# Altium schematic sheet MCU.SchDoc
size A3
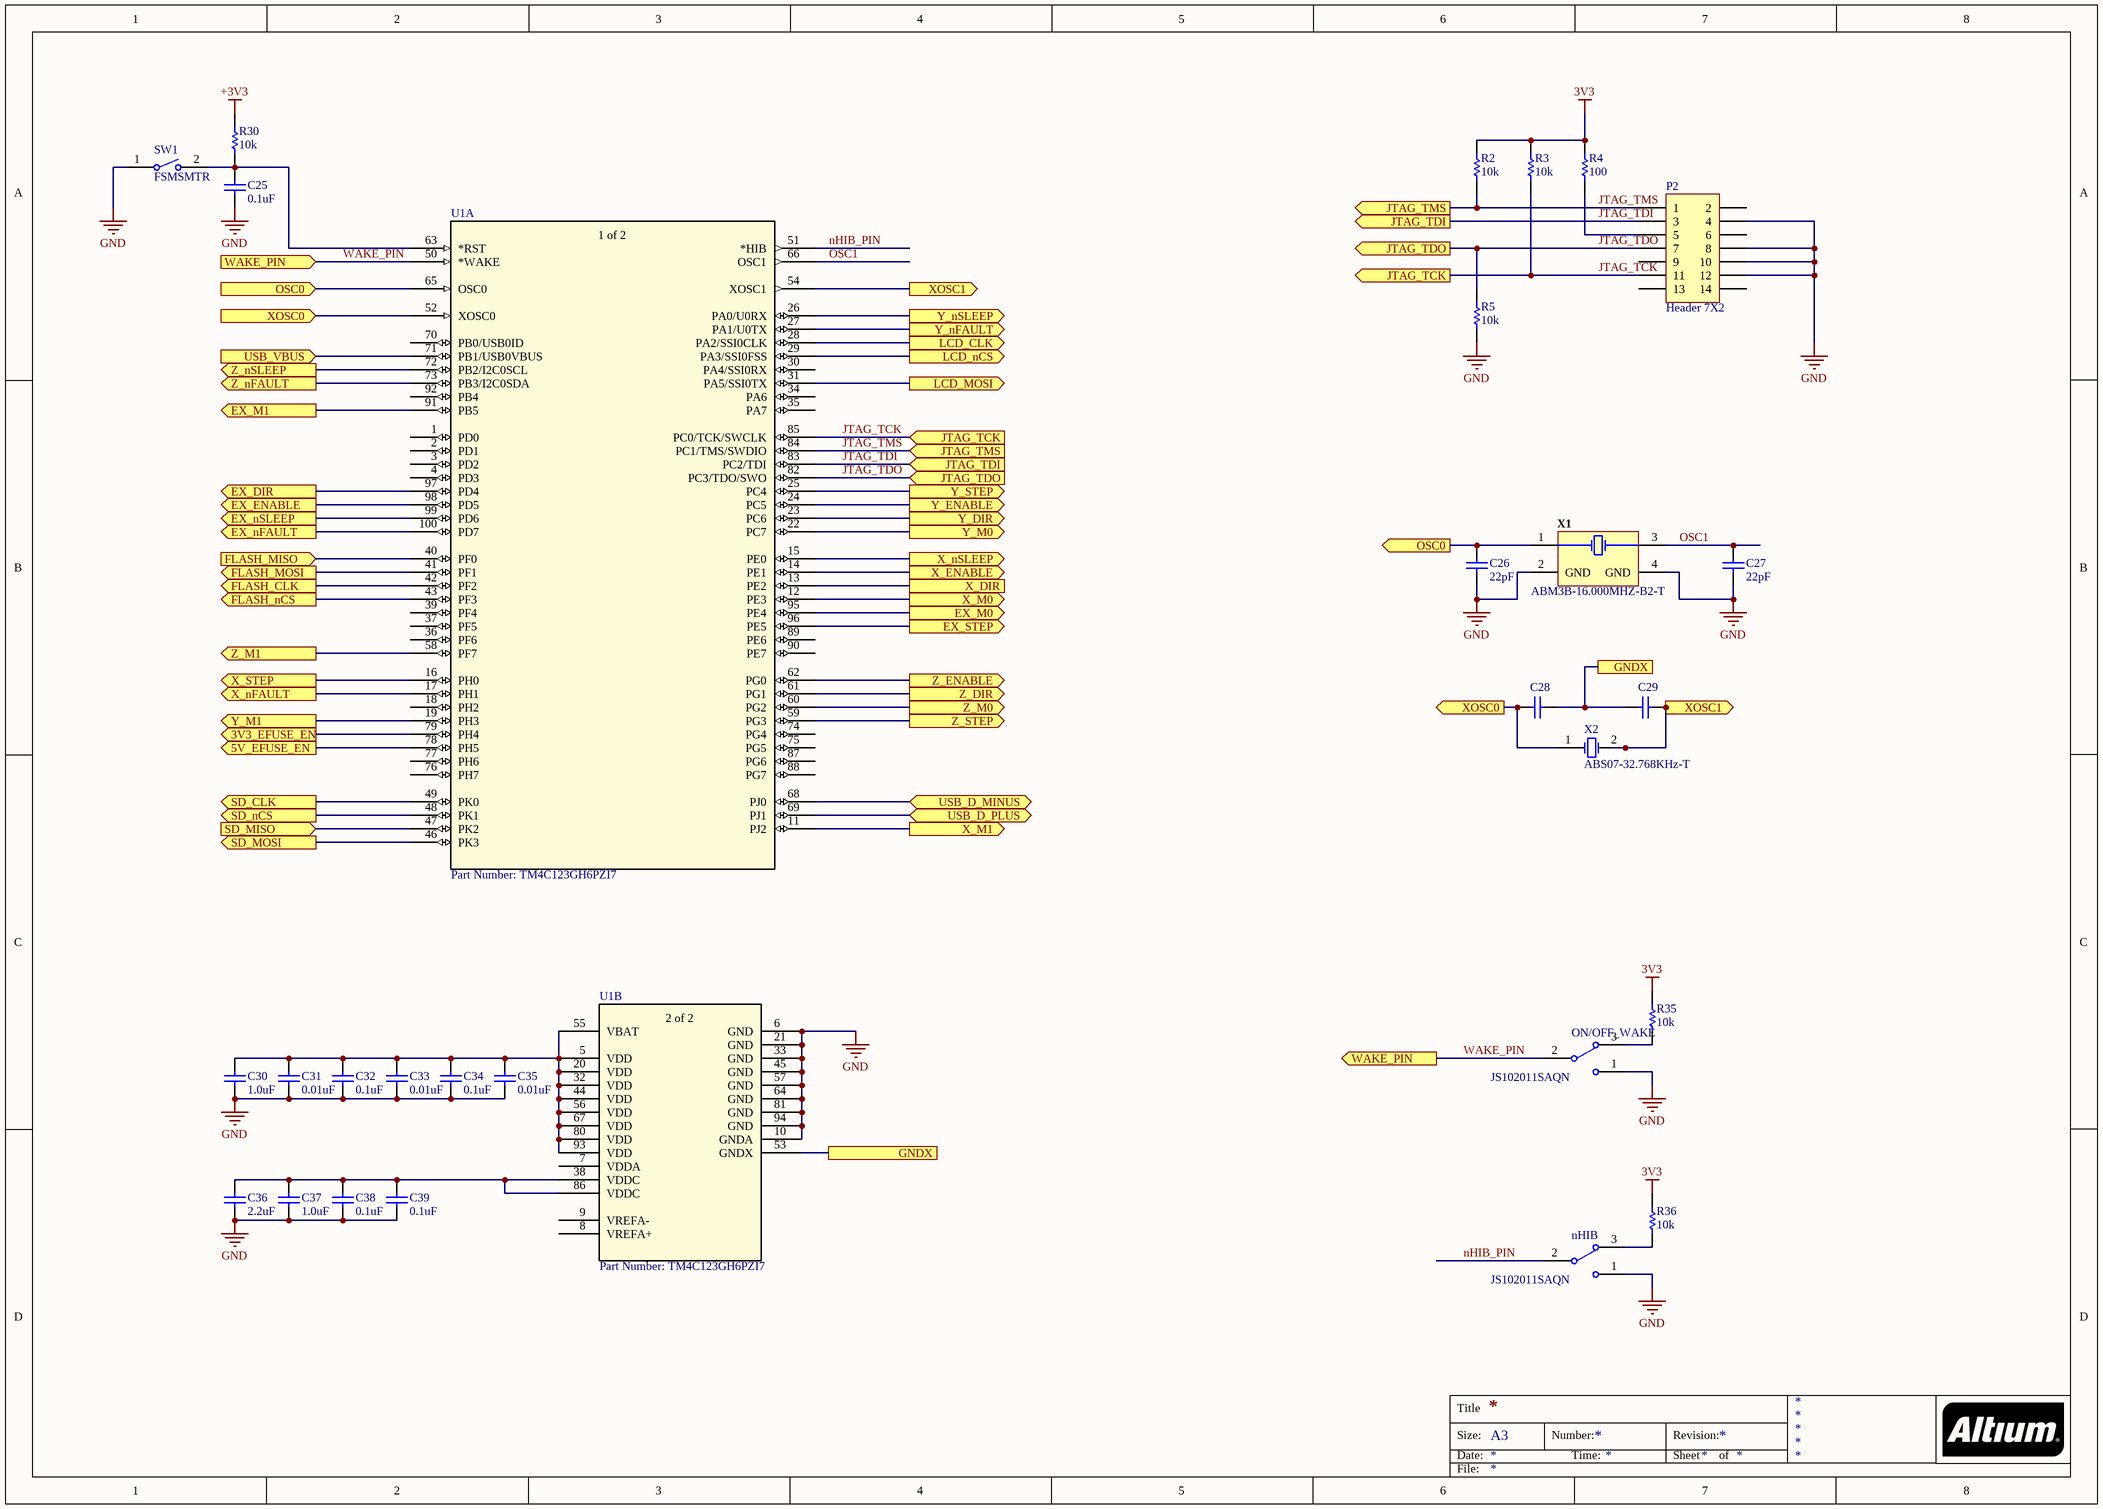
[diagram p0: MCU.SchDoc]

## Parts
C25  0.1uF  [CAPC1608X90X35ML10T15]
C26  22pF  [CAPC1608X90X35ML10T15]
C27  22pF  [CAPC1608X90X35ML10T15]
C28  GRM1885C1H120JA01D  [CAPC1608X90X35ML10T15]  (value not drawn)
C29  GRM1885C1H120JA01D  [CAPC1608X90X35ML10T15]  (value not drawn)
C30  1.0uF  [CAPC1608X60X35NL10T15]
C31  0.01uF  [CAPC1608X87X35ML15T15]
C32  0.1uF  [CAPC1608X90X35ML10T15]
C33  0.01uF  [CAPC1608X87X35ML15T15]
C34  0.1uF  [CAPC1608X90X35ML10T15]
C35  0.01uF  [CAPC1608X87X35ML15T15]
C36  2.2uF  [CAPC1608X90X35ML10T15]
C37  1.0uF  [CAPC1608X60X35NL10T15]
C38  0.1uF  [CAPC1608X90X35ML10T15]
C39  0.1uF  [CAPC1608X90X35ML10T15]
nHIB  JS102011SAQN  [CKCP-JS102011SAQN-3_V]
ON/OFF_WAKE  JS102011SAQN  [CKCP-JS102011SAQN-3_V]
P2  Header 7X2  [HDR2X7]
R2  10k  [RESC1608X55X30LL15T15]
R3  10k  [RESC1608X55X30LL15T15]
R4  100  [RESC1608X55X30LL15T15]
R5  10k  [RESC1608X55X30LL15T15]
R30  10k  [RESC1608X55X30LL15T15]
R35  10k  [RESC1608X55X30LL15T15]
R36  10k  [RESC1608X55X30LL15T15]
SW1  FSMSMTR  [TECO-FSMSMTR_V]
U1  Part Number: TM4C123GH6PZI7  [PZ100]  (parts A,B of 2)
X1  ABM3B-16.000MHZ-B2-T  [ABRA-ABM3B-4_V]
X2  ABS07-32.768KHz-T  [ABRA-ABS07-2_V]

## Ports
3V3_EFUSE_EN (out), 5V_EFUSE_EN (out), EX_DIR (out), EX_ENABLE (out), EX_M0 (out), EX_M1 (out), EX_nFAULT (out), EX_nSLEEP (out), EX_STEP (out), FLASH_CLK (out), FLASH_MISO (in), FLASH_MOSI (out), FLASH_nCS (out), GNDX, JTAG_TCK (in), JTAG_TCK (out), JTAG_TDI (in), JTAG_TDI (out), JTAG_TDO (in), JTAG_TDO (out), JTAG_TMS (in), JTAG_TMS (out), LCD_CLK (out), LCD_MOSI (out), LCD_nCS (out), OSC0 (in), OSC0 (out), SD_CLK (out), SD_MISO (in), SD_MOSI (out), SD_nCS (out), USB_D_MINUS (bidir), USB_D_PLUS (bidir), USB_VBUS (in), WAKE_PIN (in), WAKE_PIN (out), X_DIR, X_ENABLE (out), X_M0 (out), X_M1 (out), X_nFAULT (out), X_nSLEEP (out), X_STEP (out), XOSC0 (in), XOSC0 (out), XOSC1 (out), Y_DIR (out), Y_ENABLE (out), Y_M0 (out), Y_M1 (out), Y_nFAULT (out), Y_nSLEEP (out), Y_STEP (out), Z_DIR (out), Z_ENABLE (out), Z_M0 (out), Z_M1 (out), Z_nFAULT (out), Z_nSLEEP (out), Z_STEP (out)

## Nets
3V3: R2.2 R3.2 R4.2 R35.2 R36.2
+3V3: R30.2
GND: C25.1 C26.1 C27.1 C30.1 C31.1 C32.1 C33.1 C34.1 C35.1 C36.1 C37.1 C38.1 C39.1 nHIB.1 ON/OFF_WAKE.1 P2.4 P2.8 P2.10 P2.12 R5.1 SW1.1 U1.6(GND) U1.10(GNDA) U1.21(GND) U1.33(GND) U1.45(GND) U1.57(GND) U1.64(GND) U1.81(GND) U1.94(GND) X1.2(GND) X1.4(GND)
3V3_EFUSE_EN: U1.79(PH4) ; port 3V3_EFUSE_EN
5V_EFUSE_EN: U1.78(PH5) ; port 5V_EFUSE_EN
EX_DIR: U1.97(PD4) ; port EX_DIR
EX_ENABLE: U1.98(PD5) ; port EX_ENABLE
EX_M0: U1.95(PE4) ; port EX_M0
EX_M1: U1.91(PB5) ; port EX_M1
EX_nFAULT: U1.100(PD7) ; port EX_nFAULT
EX_nSLEEP: U1.99(PD6) ; port EX_nSLEEP
EX_STEP: U1.96(PE5) ; port EX_STEP
FLASH_CLK: U1.42(PF2) ; port FLASH_CLK
FLASH_MISO: U1.40(PF0) ; port FLASH_MISO
FLASH_MOSI: U1.41(PF1) ; port FLASH_MOSI
FLASH_nCS: U1.43(PF3) ; port FLASH_nCS
GNDX: C28.2 C29.1 U1.53(GNDX) ; port GNDX
JTAG_TCK: P2.11 R3.1 U1.85(PC0/TCK/SWCLK) ; port JTAG_TCK
JTAG_TDI: P2.3 U1.83(PC2/TDI) ; port JTAG_TDI
JTAG_TDO: P2.7 R5.2 U1.82(PC3/TDO/SWO) ; port JTAG_TDO
JTAG_TMS: P2.1 R2.1 U1.84(PC1/TMS/SWDIO) ; port JTAG_TMS
LCD_CLK: U1.28(PA2/SSI0CLK) ; port LCD_CLK
LCD_MOSI: U1.31(PA5/SSI0TX) ; port LCD_MOSI
LCD_nCS: U1.29(PA3/SSI0FSS) ; port LCD_nCS
nHIB_PIN: nHIB.2 U1.51(*HIB)
OSC0: C26.2 U1.65(OSC0) X1.1(X1) ; port OSC0
OSC1: C27.2 U1.66(OSC1) X1.3(X2)
SD_CLK: U1.49(PK0) ; port SD_CLK
SD_MISO: U1.47(PK2) ; port SD_MISO
SD_MOSI: U1.46(PK3) ; port SD_MOSI
SD_nCS: U1.48(PK1) ; port SD_nCS
USB_D_MINUS: U1.68(PJ0) ; port USB_D_MINUS
USB_D_PLUS: U1.69(PJ1) ; port USB_D_PLUS
USB_VBUS: U1.71(PB1/USB0VBUS) ; port USB_VBUS
WAKE_PIN: ON/OFF_WAKE.2 U1.50(*WAKE) ; port WAKE_PIN
X_DIR: U1.13(PE2) ; port X_DIR
X_ENABLE: U1.14(PE1) ; port X_ENABLE
X_M0: U1.12(PE3) ; port X_M0
X_M1: U1.11(PJ2) ; port X_M1
X_nFAULT: U1.17(PH1) ; port X_nFAULT
X_nSLEEP: U1.15(PE0) ; port X_nSLEEP
X_STEP: U1.16(PH0) ; port X_STEP
XOSC0: C28.1 U1.52(XOSC0) X2.1(X1) ; port XOSC0
XOSC1: C29.2 U1.54(XOSC1) X2.2(X2) ; port XOSC1
Y_DIR: U1.23(PC6) ; port Y_DIR
Y_ENABLE: U1.24(PC5) ; port Y_ENABLE
Y_M0: U1.22(PC7) ; port Y_M0
Y_M1: U1.19(PH3) ; port Y_M1
Y_nFAULT: U1.27(PA1/U0TX) ; port Y_nFAULT
Y_nSLEEP: U1.26(PA0/U0RX) ; port Y_nSLEEP
Y_STEP: U1.25(PC4) ; port Y_STEP
Z_DIR: U1.61(PG1) ; port Z_DIR
Z_ENABLE: U1.62(PG0) ; port Z_ENABLE
Z_M0: U1.60(PG2) ; port Z_M0
Z_M1: U1.58(PF7) ; port Z_M1
Z_nFAULT: U1.73(PB3/I2C0SDA) ; port Z_nFAULT
Z_nSLEEP: U1.72(PB2/I2C0SCL) ; port Z_nSLEEP
Z_STEP: U1.59(PG3) ; port Z_STEP
NetC25_2: C25.2 R30.1 SW1.2 U1.63(*RST)
NetC30_2: C30.2 C31.2 C32.2 C33.2 C34.2 C35.2 U1.5(VDD) U1.20(VDD) U1.32(VDD) U1.44(VDD) U1.55(VBAT) U1.56(VDD) U1.67(VDD) U1.80(VDD) U1.93(VDD)
NetC36_2: C36.2 C37.2 C38.2 C39.2 U1.38(VDDC) U1.86(VDDC)
NetnHIB_3: nHIB.3 R36.1
NetON/OFF_WAKE_3: ON/OFF_WAKE.3 R35.1
NetP2_5: P2.5 R4.1

Not connected (* = marked no-connect by the designer): P2 2 6 9 13 14; U1 1(PD0) 2(PD1) 3(PD2) 4(PD3) 7(VDDA) 8(VREFA+) 9(VREFA-) 18(PH2) 30(PA4/SSI0RX) 34(PA6) 35(PA7) 36(PF6) 37(PF5) 39(PF4) 70(PB0/USB0ID) 74(PG4) 75(PG5) 76(PH7) 77(PH6) 87(PG6) 88(PG7) 89(PE6) 90(PE7) 92(PB4)

## Notes on the sheet
- Title
- Size:
- Date:
- A3
- Number:
- Time:
- Revision:
- Sheet
- of
- File:
- (in symbol TM4C123GH6PZI7, part A) 1 of 2
- (in symbol TM4C123GH6PZI7, part B) 2 of 2

## Library data of the parts
C25 C32 C34 C38 C39 = CMP-2100-03643-1: Chip Capacitor, 0.1 uF, +/- 10%, 50 V, -55 to 125 degC, 0603 (1608 Metric), RoHS, Tape and Reel; Manufacturer: Murata; Dielectric Material: Ceramic; Voltage Rating: 50V; Capacitance: 100nF; Dielectric: X7R; Insulation Resistance: 10GR; Case Code (Metric): 1608; Lead Free: LeadFree; Depth: 0.8mm; Number of Pins: 2; Radiation Hardening: No; Case/Package: 0603; Manufacturer URL: http://www.murata.com/; Packaging: TapeandReel; Length: 1.6mm; Contact Plating: Tin; Datasheet URL: http://psearch.en.murata.com/capacitor/product/GRM188R71H104KA93%23.pdf; Tolerance: 10%; Case Code (Imperial): 0603; Min Operating Temperature: -55degC; RoHSCompliant: true; Voltage: 50V; Termination: SMD/SMT; Mount: SurfaceMount; Material: Ceramic; Package Quantity: 1; Height: 0.8mm; Thickness: 0.035inch; REACH SVHC: NoSVHC; Max Operating Temperature: 125degC; Width: 0.8mm; Package Reference: 0603; Voltage Rating (DC): 50V; Datasheet Version: 42675.0; Package Description: 2-Pin Surface Mount Device, Body 1.6 x 0.8 mm
C26 C27 = CMP-2006-02602-1: Part Number: GRM1885C1H120JA01D; Manufacturer: Murata
C28 C29 = CMP-2006-02602-1: Manufacturer: Murata; Part Number: GRM1885C1H120JA01D
C30 C37 = CMP-2006-00116-1: Manufacturer: Murata; Part Number: GRM185R61C105KE44J
C31 C33 C35 = CMP-2006-03042-1: Part Number: C0603C103K4RACTU; Manufacturer: Kemet
C36 = CMP-2006-02836-1: Manufacturer: Murata; Part Number: GRM188R71A225KE15D
nHIB ON/OFF_WAKE = CMP-2000-06501-1: Sub-Miniature Slide Switch, SPDT, -40 to 85 degC, 3-Pin SMD, RoHS, Tape and Reel; Manufacturer: C&K Components; Electrical Life: 15000Cycles; Actuator Color: Black; Body Orientation: RightAngle; Minimum Insulation Resistance: 100MOhm; Contact Rating @ Voltage: 0.3@6VDCA; Actuator Style: SideSlide; Maximum DC Voltage Rating: 6V; COO: US; Actuator Material: Nylon4/6; Dielectric Strength: 500VAC; Maximum Contact Resistance: 70mOhm; Base Material: N/A; Mounting Technology: SurfaceMount; Switch Configuration: N/A; Package Reference: SMT; Package Description: 3-Pin Surface Mount Device, Body 9 x 3.6 mm, Height 3.5 mm; Mounting: SurfaceMount,GullWing; Part No: JS102011SAQN; Dimension: 9x4.3mm; Type: Sub-Miniature; Product Weight: N/A; Seal Location: N/A; Family: JS; ECCN: EAR99; Supplier: C&KComponents; Seal Description: N/A; Contact Plating: Silver; Pole Throw Configuration: SPDT; Packaging: TapeandReel; Manufacturer URL: http://www.ckswitches.com/; Datasheet URL: https://datasheet.ciiva.com/1532/js-9dec14-1532400.pdf; Maximum AC Voltage Rating: N/A; Mechanical Life: N/A; HTS: 8536509050; Datasheet Version: 12/2014; Housing Material: Nylon4/6; Contact Material: CopperAlloy; RoHS: Yes; Operating Temperature: -40to85C
P2 = Header 7X2: Header, 7-Pin, Dual row; LatestRevisionDate: 17-Jul-2002; LatestRevisionNote: Re-released for DXP Platform.; Publisher: Altium Limited
R2-R5 R30 R35 R36 = CMP-2000-00181-1: Part Number: ERJ-3EKF1002V; Manufacturer: Panasonic
SW1 = CMP-2000-07501-1: FSMSM Push Button Switch, 50 mA, -35 to 85 degC, 2-Pin SMD, RoHS, Tape and Reel; Manufacturer: TE Connectivity; Voltage Rating (DC): 24V; Electrical Life: 20000Cycles; Operating Force: 180gf; Switch Travel: 0.25mm; Contact Current Rating: 50mA; Case\/Package: SMD/SMT; Actuator Length: 1.07mm; Throw Configuration: SPST; Actuator Material: Polyamide; Contact Resistance: 100mOhm; Illumination Type: Illuminated; Max Voltage Rating (DC): 12V; Manufacturer URL: http://www.te.com/; Lead Free: LeadFree; Packaging: TapeandReel; Min Operating Temperature: -35degC; Mechanical Life: 20000Cycles; Mount: SurfaceMount; REACH SVHC: Unknown; Package Quantity: 1800; Package Reference: FSMSMTR; RoHSCompliant: true; Max Operating Temperature: 85degC; Orientation: Straight; ELV: Compliant; Datasheet URL: http://www.te.com/commerce/DocumentDelivery/DDEController?Action=showdoc&DocId=Customer+Drawing%7F1437566-3%7FC2%7Fpdf%7FEnglish%7FENG_CD_1437566-3_C2_1437566_3_1_c.dwg.pdf%7F1437566-4; Package Description: 2-Pin Surface Mount Device, Body 6 x 3.5 mm, Pitch 9.19 mm; Current Rating: 50mA; Contact Plating: Silver; Termination: GullWing; Datasheet Version: Rev. C2, 08/2014; Contact Material: Brass; Mounting Technology: SurfaceMount
U1 = TM4C123GH6PZI7: No Description Available; Built_By: EMA_UL_Team; Vendor: Texas Instruments; Manufacturer_Part_Number: TM4C123GH6PZI7; Copyright: Copyright (C) 2018 Accelerated Designs. All rights reserved; RefDes: RefDes; Type: DEV; Value: Value
X1 = CMP-1688-00003-1: Ceramic SMD Crystal, 16 MHz, +/- 20 ppm, 50 Ohm, -20 to 70 degC, 4-Pin SMD, RoHS, Tape and Reel; Current Rating: 1.82 A; Resistance: 0.033 Ohm; Tolerance: 30%; Shielding: Shielded; REACH SVHC: Unknown; RoHSCompliant: True; PackageReference: ABM3B; Mount: Surface Mount; Max Operating Temperature: 105degC; DatasheetVersion: Aug-15; Package Quantity: 500; PackageDescription: 4-Pin Surface Mount Device, Body 5 x 3.2 mm; ComponentLink2URL: http://www.abracon.com/Resonators/abm3b.pdf; Packaging: Tape and Reel; Height: 2.8 mm; ComponentLink1URL: http://www.abracon.com/; ComponentLink2Description: Datasheet; Length: 0.197 inch; ComponentLink1Description: Manufacturer URL; Case/Package: 5028; Width: 0.197 inch; Min Operating Temperature: -40degC
X2 = CMP-0447-00001-2: Crystal, 32.768 kHz, 12.5 pF, -40 to 85 degC, SMD Low Profile 3.2 x 1.5 x 0.9 mm, Tape and Reel; Manufacturer: Abracon; Q Value (Type): 30000; Operation Mode: Flexural Mode (Tuning Fork); Shunt Capacitance (C0): 0.9 to 1.2 pF; Load Capacitance (CL): 12.5 pF; Frequency Tolerance @+25degC: +/- 20 ppm; Drive Level (Type): 0.1 uW; Equivalent Series Resistance (R1): 70 Kohm; Insulation Resistance (Min): 500 Mohm; ComponentLink3URL: http://www.abracon.com/Resonators/ABS07.pdf; PackageDescription: 2-Pin Hand Drawn, Body 3.2x1.5mm, Pitch 2.5mm; Operating Temperature: -40 to 85 degC; ComponentLink2URL: http://www.abracon.com/Resonators/ABS07.pdf; PackageReference: ABS07-2; ComponentLink3Description: Package Specification; ComponentLink1Description: Manufacturer URL; DatasheetVersion: 04.03.13; Mounting Technology: Surface Mount; ComponentLink2Description: Datasheet; ComponentLink1URL: http://www.abracon.com/; PartNumber: ABS07-32.768KHz-T; Packing: Tape and Reel; Frequency: 32.768 kHz